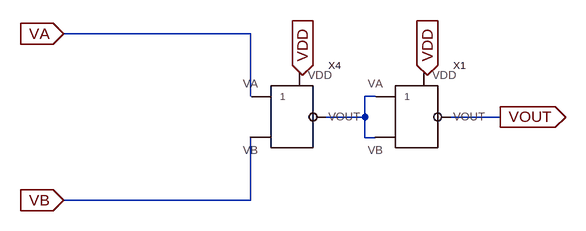
[diagram p0: schematic aorb.asc]
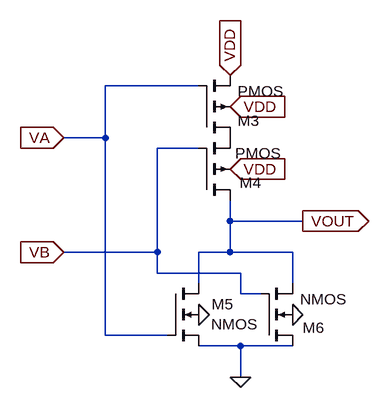
[diagram p1: sub-circuit nor.asc]
aorb.asc, the LTspice schematic file:
Version 4
SHEET 1 1372 1632
WIRE 400 576 112 576
WIRE 400 672 400 576
WIRE 592 672 576 672
WIRE 576 704 576 672
WIRE 576 704 512 704
WIRE 784 704 704 704
WIRE 576 736 576 704
WIRE 592 736 576 736
WIRE 400 832 400 736
WIRE 400 832 112 832
FLAG 112 576 VA
IOPIN 112 576 In
FLAG 112 832 VB
IOPIN 112 832 In
FLAG 480 640 VDD
IOPIN 480 640 In
FLAG 784 704 VOUT
IOPIN 784 704 Out
FLAG 672 640 VDD
IOPIN 672 640 In
SYMBOL nor 464 704 R0
SYMATTR InstName X4
SYMBOL nor 656 704 R0
SYMATTR InstName X1

nor.asc, the sub-circuit schematic file:
Version 4
SHEET 1 880 680
WIRE -656 -16 -800 -16
WIRE -800 64 -800 -16
WIRE -800 64 -864 64
WIRE -656 80 -720 80
WIRE -608 192 -608 160
WIRE -496 192 -608 192
WIRE -720 240 -720 80
WIRE -720 240 -864 240
WIRE -608 240 -608 192
WIRE -608 240 -656 240
WIRE -512 240 -608 240
WIRE -720 272 -720 240
WIRE -592 272 -720 272
WIRE -656 288 -656 240
WIRE -512 288 -512 240
WIRE -592 304 -592 272
WIRE -560 304 -592 304
WIRE -800 368 -800 64
WIRE -704 368 -800 368
WIRE -592 384 -656 384
WIRE -512 384 -592 384
WIRE -592 432 -592 384
FLAG -592 432 0
FLAG -608 -32 VDD
IOPIN -608 -32 In
FLAG -656 336 0
FLAG -512 336 0
FLAG -864 64 VA
IOPIN -864 64 In
FLAG -864 240 VB
IOPIN -864 240 In
FLAG -496 192 VOUT
IOPIN -496 192 Out
FLAG -608 16 VDD
IOPIN -608 16 In
FLAG -608 112 VDD
IOPIN -608 112 In
SYMBOL pmos4 -656 64 M180
WINDOW 0 60 26 Left 2
WINDOW 3 60 72 Left 2
SYMATTR InstName M3
SYMBOL pmos4 -656 160 M180
WINDOW 0 63 27 Left 2
SYMATTR InstName M4
SYMBOL nmos4 -704 288 R0
WINDOW 0 68 32 Left 2
WINDOW 3 67 63 Left 2
SYMATTR InstName M5
SYMBOL nmos4 -560 384 M180
WINDOW 0 64 28 Left 2
WINDOW 3 60 72 Left 2
SYMATTR InstName M6

The netlist it stands for:
* aorb.asc
XX4 VA VB VDD N001 nor
XX1 N001 N001 VDD VOUT nor

* block symbol definitions
.subckt nor VA VB VDD VOUT
M3 P001 VA VDD VDD PMOS
M4 VOUT VB P001 VDD PMOS
M5 VOUT VA 0 0 NMOS
M6 0 VB VOUT 0 NMOS
.ends nor

.model NMOS NMOS
.model PMOS PMOS
.lib standard.mos
.backanno
.end